# Altium schematic sheet sdcard.SchDoc
size A4
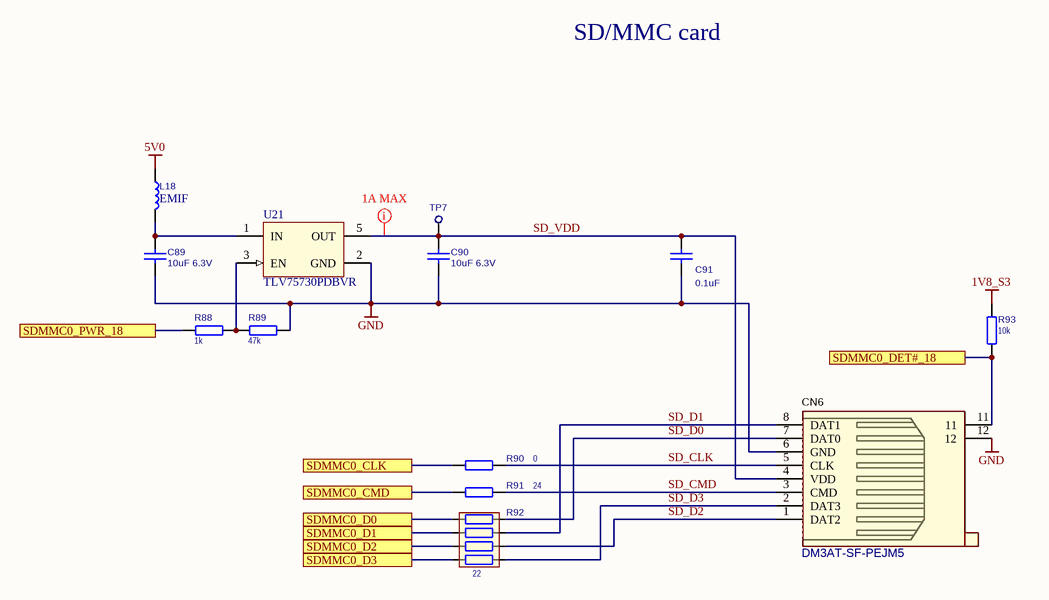
[diagram p0: sdcard.SchDoc]

## Parts
C89  value 10uF 6.3V  [C0603]  (hidden comment: CC0603MRX5R5BB106)
C90  value 10uF 6.3V  [C0603]  (hidden comment: CC0603MRX5R5BB106)
C91  value 0.1uF  [C0603]  (hidden comment: C1608X7R1H104K080AA)
CN6  DM3AT-SF-PEJM5  [mSD_TF_push]
L18  value EMIF  [IND0603]  (hidden comment: BLM18AG102SN1D)
R88  1k  [R0603]
R89  47k  [R0603]
R90  0  [R0603]
R91  value 24  [R0603]  (hidden comment: 22)
R92  value 22  [R0804X4]  (hidden comment: TC124-JR-0722RL)
R93  10k  [R0603]
TP7  TEST-POINT  [PAD]  (value not drawn)
U21  TLV75730PDBVR  [SOT-23-5]

## Ports
SDMMC0_CLK, SDMMC0_CMD, SDMMC0_D0, SDMMC0_D1, SDMMC0_D2, SDMMC0_D3, SDMMC0_DET#_18, SDMMC0_PWR_18

## Nets
1V8_S3: R93.2
5V0: L18.1
GND: C89.2 C90.2 C91.1 CN6.6(GND) CN6.12 R89.2 U21.2(GND)
SD_CLK: CN6.5(CLK) R90.1
SD_CMD: CN6.3(CMD) R91.1
SD_D0: CN6.7(DAT0) R92.2
SD_D1: CN6.8(DAT1) R92.4
SD_D2: CN6.1(DAT2) R92.6
SD_D3: CN6.2(DAT3) R92.8
SD_VDD: C90.1 C91.2 CN6.4(VDD) TP7.1 U21.5(OUT)
SDMMC0_CLK: R90.2 ; port SDMMC0_CLK
SDMMC0_CMD: R91.2 ; port SDMMC0_CMD
SDMMC0_D0: R92.1 ; port SDMMC0_D0
SDMMC0_D1: R92.3 ; port SDMMC0_D1
SDMMC0_D2: R92.5 ; port SDMMC0_D2
SDMMC0_D3: R92.7 ; port SDMMC0_D3
SDMMC0_DET#_18: CN6.11 R93.1 ; port SDMMC0_DET#_18
SDMMC0_PWR_18: R88.1 ; port SDMMC0_PWR_18
NetC89_1: C89.1 L18.2 U21.1(IN)
NetR88_2: R88.2 R89.1 U21.3(EN)

## Layout directives
mark named 1A MAX: SD_VDD

## Notes on the sheet
- SD/MMC card

## Library data of the parts
C89-C91 = CAP_NPOL
CN6 = uSD card socket: In Stock: 0; Type: Connectors; Price: 0.00; Supplier: Rusar; Supplier PN: xxx
L18 = IND_WO_IRON
R88-R91 R93 = RESISTOR: RES
  R88: Value: 1k
  R89: Value: 47k
  R90: Value: 0
  R93: Value: 10k
R92 = ARRAY
TP7 = TEST-POINT: PCB terminal block; Value: *
U21 = TLV733P: Capacitor-Free, 300-mA, Low-Dropout Regulator with Foldback Current Limit for Portable Devices; value: TLV733P